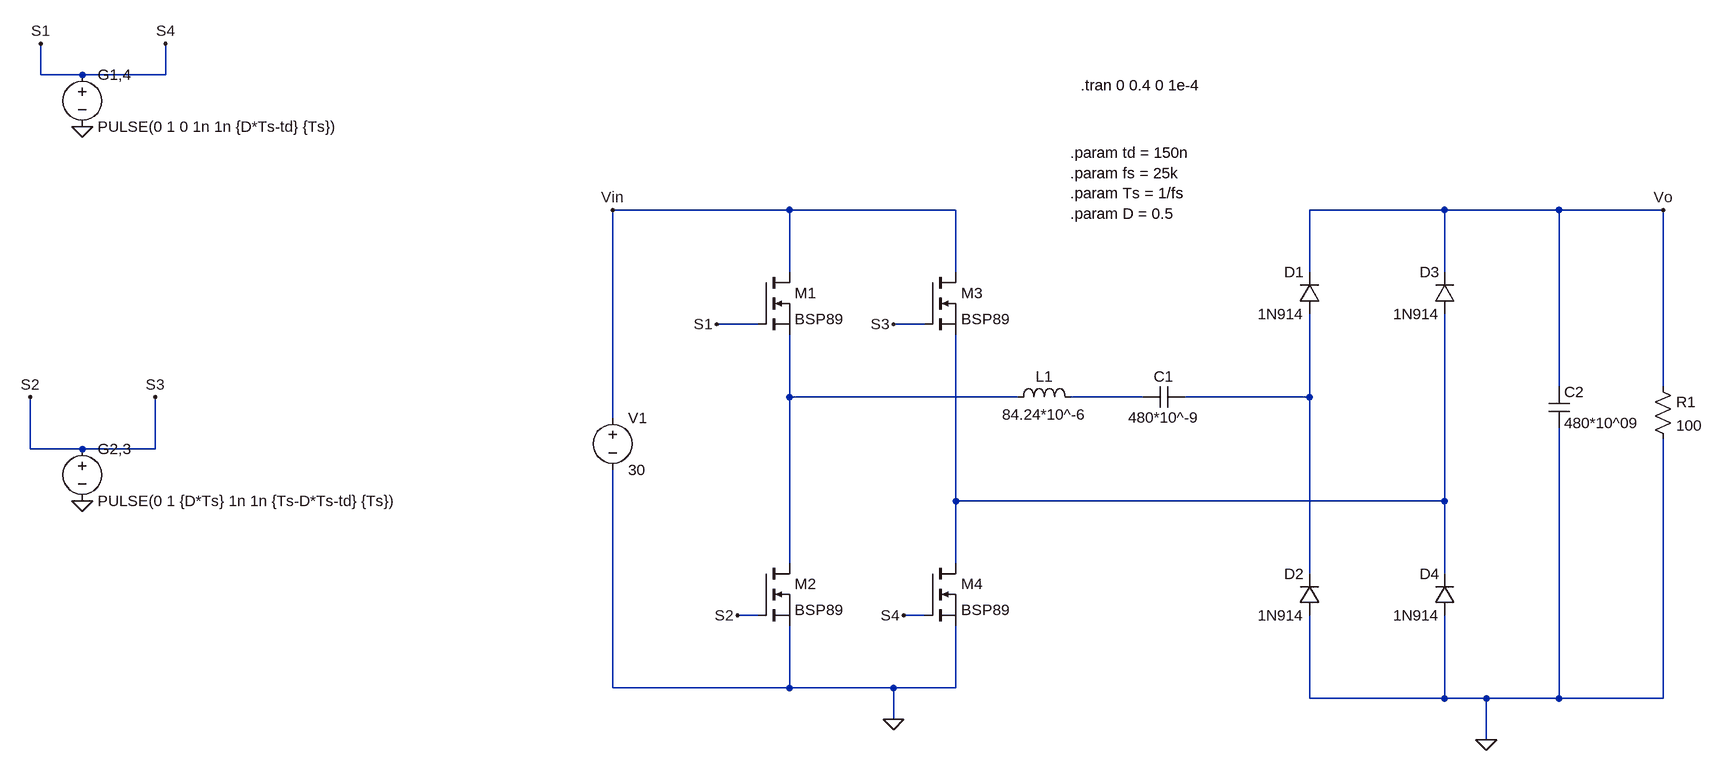
[diagram p0: schematic SRC.asc]
SRC.asc, the LTspice schematic file:
Version 4
SHEET 1 1652 680
WIRE -912 -432 -912 -480
WIRE -848 -432 -912 -432
WIRE -720 -432 -720 -480
WIRE -720 -432 -848 -432
WIRE 240 -224 -32 -224
WIRE 496 -224 240 -224
WIRE 1248 -224 1040 -224
WIRE 1424 -224 1248 -224
WIRE 1584 -224 1424 -224
WIRE 240 -128 240 -224
WIRE 496 -128 496 -224
WIRE 1040 -128 1040 -224
WIRE 1248 -128 1248 -224
WIRE 192 -48 128 -48
WIRE 448 -48 400 -48
WIRE 1424 48 1424 -224
WIRE 1584 48 1584 -224
WIRE 240 64 240 -32
WIRE 592 64 240 64
WIRE 784 64 672 64
WIRE 1040 64 1040 -64
WIRE 1040 64 848 64
WIRE -32 96 -32 -224
WIRE -928 144 -928 64
WIRE -848 144 -928 144
WIRE -736 144 -736 64
WIRE -736 144 -848 144
WIRE 496 224 496 -32
WIRE 1248 224 1248 -64
WIRE 1248 224 496 224
WIRE 240 320 240 64
WIRE 496 320 496 224
WIRE 1040 336 1040 64
WIRE 1248 336 1248 224
WIRE 192 400 160 400
WIRE 448 400 416 400
WIRE -32 512 -32 176
WIRE 240 512 240 416
WIRE 240 512 -32 512
WIRE 400 512 240 512
WIRE 496 512 496 416
WIRE 496 512 400 512
WIRE 1040 528 1040 400
WIRE 1248 528 1248 400
WIRE 1248 528 1040 528
WIRE 1312 528 1248 528
WIRE 1424 528 1424 112
WIRE 1424 528 1312 528
WIRE 1584 528 1584 128
WIRE 1584 528 1424 528
WIRE 400 560 400 512
WIRE 1312 592 1312 528
FLAG 400 560 0
FLAG 1312 592 0
FLAG -32 -224 Vin
FLAG 1584 -224 Vo
FLAG -848 -352 0
FLAG -848 224 0
FLAG 128 -48 S1
FLAG 160 400 S2
FLAG 400 -48 S3
FLAG 416 400 S4
FLAG -912 -480 S1
FLAG -720 -480 S4
FLAG -928 64 S2
FLAG -736 64 S3
SYMBOL voltage -32 80 R0
WINDOW 123 0 0 Left 0
WINDOW 39 0 0 Left 0
SYMATTR InstName V1
SYMATTR Value 30
SYMBOL nmos 192 -128 R0
SYMATTR InstName M1
SYMATTR Value BSP89
SYMBOL nmos 192 320 R0
SYMATTR InstName M2
SYMATTR Value BSP89
SYMBOL nmos 448 -128 R0
SYMATTR InstName M3
SYMATTR Value BSP89
SYMBOL nmos 448 320 R0
SYMATTR InstName M4
SYMATTR Value BSP89
SYMBOL ind 576 80 R270
WINDOW 0 32 56 VTop 2
WINDOW 3 5 56 VBottom 2
SYMATTR InstName L1
SYMATTR Value 84.24*10^-6
SYMBOL cap 784 80 R270
WINDOW 0 32 32 VTop 2
WINDOW 3 0 32 VBottom 2
SYMATTR InstName C1
SYMATTR Value 480*10^-9
SYMBOL diode 1056 -64 R180
WINDOW 0 24 64 Left 2
WINDOW 3 24 0 Left 2
SYMATTR InstName D1
SYMATTR Value 1N914
SYMBOL diode 1056 400 R180
WINDOW 0 24 64 Left 2
WINDOW 3 24 0 Left 2
SYMATTR InstName D2
SYMATTR Value 1N914
SYMBOL diode 1264 -64 R180
WINDOW 0 24 64 Left 2
WINDOW 3 24 0 Left 2
SYMATTR InstName D3
SYMATTR Value 1N914
SYMBOL diode 1264 400 R180
WINDOW 0 24 64 Left 2
WINDOW 3 24 0 Left 2
SYMATTR InstName D4
SYMATTR Value 1N914
SYMBOL cap 1408 48 R0
SYMATTR InstName C2
SYMATTR Value 480*10^09
SYMBOL res 1568 32 R0
SYMATTR InstName R1
SYMATTR Value 100
SYMBOL voltage -848 -448 R0
WINDOW 123 0 0 Left 0
WINDOW 39 0 0 Left 0
SYMATTR InstName G1,4
SYMATTR Value PULSE(0 1 0 1n 1n {D*Ts-td} {Ts})
SYMBOL voltage -848 128 R0
WINDOW 123 0 0 Left 0
WINDOW 39 0 0 Left 0
SYMATTR InstName G2,3
SYMATTR Value PULSE(0 1 {D*Ts} 1n 1n {Ts-D*Ts-td} {Ts})
TEXT 688 -416 Left 2 !.tran 0 0.4 0 1e-4
TEXT 672 -312 Left 2 !.param td = 150n\n.param fs = 25k\n.param Ts = 1/fs\n.param D = 0.5

The netlist it stands for:
* SRC.asc
V1 Vin 0 30
M1 Vin S4 N001 N001 BSP89
M2 N001 S3 0 0 BSP89
M3 Vin S3 N004 N004 BSP89
M4 N004 S4 0 0 BSP89
L1 N001 N002 84.24*10^-6
C1 N002 N003 480*10^-9
D1 N003 Vo 1N914
D2 0 N003 1N914
D3 N004 Vo 1N914
D4 0 N004 1N914
C2 Vo 0 480*10^09
R1 Vo 0 100
V§G1,4 S4 0 PULSE(0 1 0 1n 1n {D*Ts-td} {Ts})
V§G2,3 S3 0 PULSE(0 1 {D*Ts} 1n 1n {Ts-D*Ts-td} {Ts})
.model D D
.lib standard.dio
.model NMOS NMOS
.model PMOS PMOS
.lib standard.mos
.tran 0 0.4 0 1e-4
.param td = 150n
.param fs = 25k
.param Ts = 1/fs
.param D = 0.5
.backanno
.end